# EAGLE schematic NixiTubeClock IN-14 (EAGLE 9.6.2)
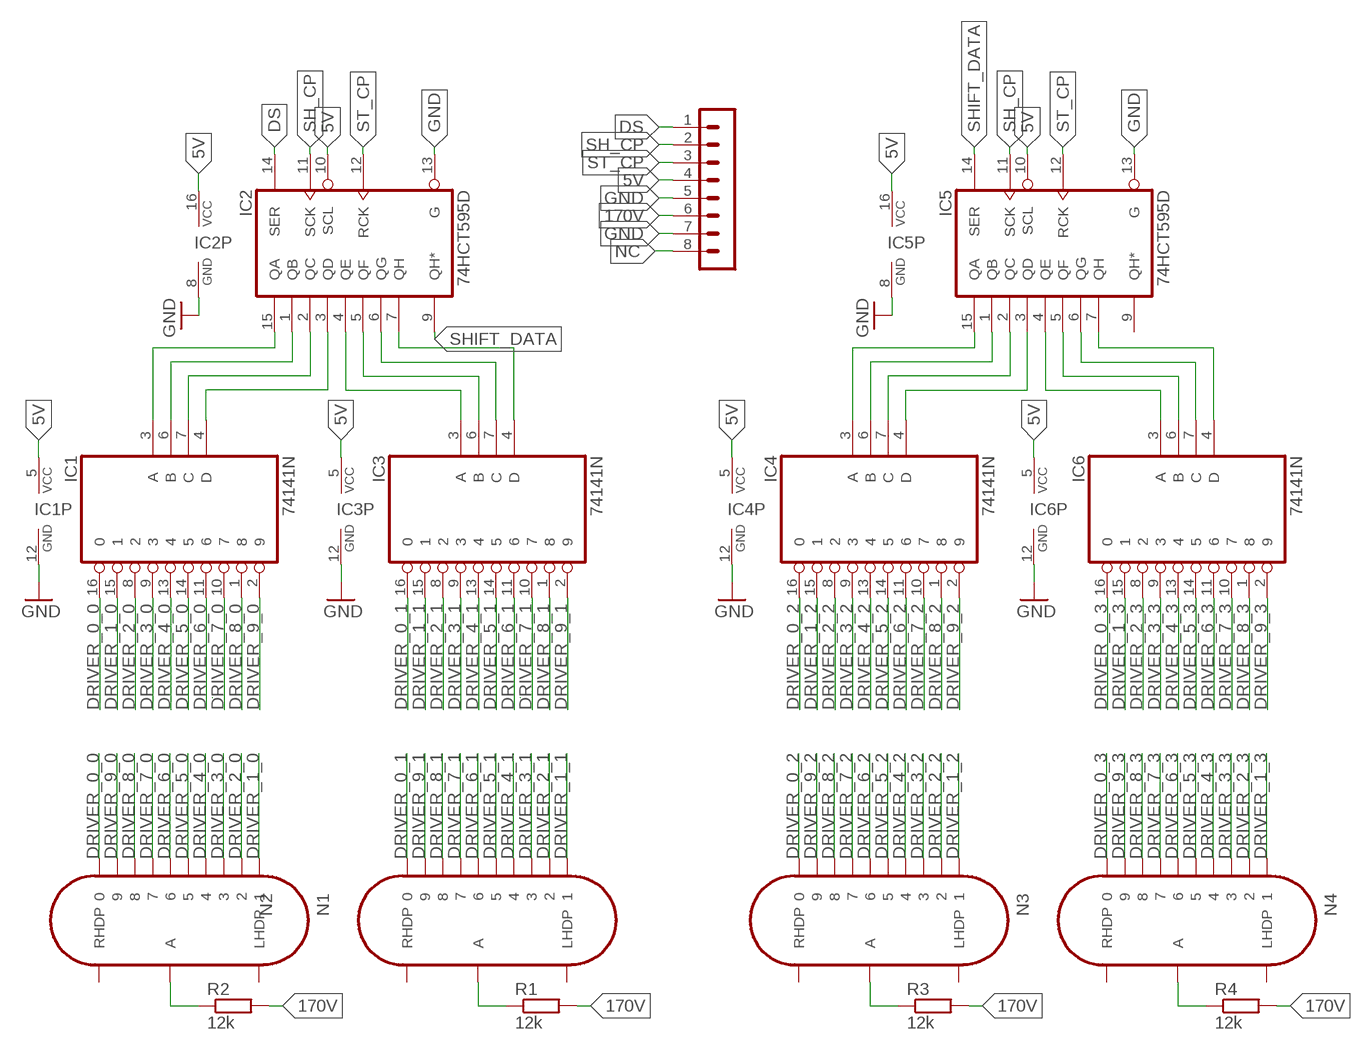
[diagram p0: schematic, sheet 1]

## Parts
IC1  74141N  [DIL16]
IC2  74HCT595D  [SO16]
IC3  74141N  [DIL16]
IC4  74141N  [DIL16]
IC5  74HCT595D  [SO16]
IC6  74141N  [DIL16]
N1  IN-14  [IN-14]
N2  IN-14  [IN-14]
N3  IN-14  [IN-14]
N4  IN-14  [IN-14]
R1  12k  R-EU_1206R1206  [R1206]
R2  12k  R-EU_1206R1206  [R1206]
R3  12k  R-EU_1206R1206  [R1206]
R4  12k  R-EU_1206R1206  [R1206]
SV2  PINHEADER-1X8  [MA08-1]

## Nets
5V: IC1.5(VCC) IC2.10(SCL) IC2.16(VCC) IC3.5(VCC) IC4.5(VCC) IC5.10(SCL) IC5.16(VCC) IC6.5(VCC) SV2.4
170V: R1.2 R2.2 R3.2 R4.2 SV2.6
DRIVER_0_0: IC1.16 N1.0
DRIVER_0_1: IC3.16 N2.0
DRIVER_0_2: IC4.16 N3.0
DRIVER_0_3: IC6.16 N4.0
DRIVER_1_0: IC1.15 N1.1
DRIVER_1_1: IC3.15 N2.1
DRIVER_1_2: IC4.15 N3.1
DRIVER_1_3: IC6.15 N4.1
DRIVER_2_0: IC1.8 N1.2
DRIVER_2_1: IC3.8 N2.2
DRIVER_2_2: IC4.8 N3.2
DRIVER_2_3: IC6.8 N4.2
DRIVER_3_0: IC1.9 N1.3
DRIVER_3_1: IC3.9 N2.3
DRIVER_3_2: IC4.9 N3.3
DRIVER_3_3: IC6.9 N4.3
DRIVER_4_0: IC1.13 N1.4
DRIVER_4_1: IC3.13 N2.4
DRIVER_4_2: IC4.13 N3.4
DRIVER_4_3: IC6.13 N4.4
DRIVER_5_0: IC1.14 N1.5
DRIVER_5_1: IC3.14 N2.5
DRIVER_5_2: IC4.14 N3.5
DRIVER_5_3: IC6.14 N4.5
DRIVER_6_0: IC1.11 N1.6
DRIVER_6_1: IC3.11 N2.6
DRIVER_6_2: IC4.11 N3.6
DRIVER_6_3: IC6.11 N4.6
DRIVER_7_0: IC1.10 N1.7
DRIVER_7_1: IC3.10 N2.7
DRIVER_7_2: IC4.10 N3.7
DRIVER_7_3: IC6.10 N4.7
DRIVER_8_0: IC1.1 N1.8
DRIVER_8_1: IC3.1 N2.8
DRIVER_8_2: IC4.1 N3.8
DRIVER_8_3: IC6.1 N4.8
DRIVER_9_0: IC1.2 N1.9
DRIVER_9_1: IC3.2 N2.9
DRIVER_9_2: IC4.2 N3.9
DRIVER_9_3: IC6.2 N4.9
DS: IC2.14(SER) SV2.1
GND: IC1.12(GND) IC2.8(GND) IC2.13(G) IC3.12(GND) IC4.12(GND) IC5.8(GND) IC5.13(G) IC6.12(GND) SV2.5 SV2.7
N$1: IC4.4(D) IC5.3(QD)
N$4: N2.A R1.1
N$5: N3.A R3.1
N$7: N4.A R4.1
N$12: N1.A R2.1
N$101: IC1.3(A) IC2.15(QA)
N$102: IC1.6(B) IC2.1(QB)
N$103: IC1.7(C) IC2.2(QC)
N$104: IC1.4(D) IC2.3(QD)
N$105: IC2.4(QE) IC3.3(A)
N$106: IC2.5(QF) IC3.6(B)
N$107: IC2.6(QG) IC3.7(C)
N$108: IC2.7(QH) IC3.4(D)
N$109: IC4.3(A) IC5.15(QA)
N$110: IC4.6(B) IC5.1(QB)
N$111: IC4.7(C) IC5.2(QC)
N$113: IC5.4(QE) IC6.3(A)
N$114: IC5.5(QF) IC6.6(B)
N$115: IC5.6(QG) IC6.7(C)
N$116: IC5.7(QH) IC6.4(D)
NC: SV2.8
SH_CP: IC2.11(SCK) IC5.11(SCK) SV2.2
SHIFT_DATA: IC2.9(QH*) IC5.14(SER)
ST_CP: IC2.12(RCK) IC5.12(RCK) SV2.3
Unconnected: IC5.9(QH*) N1.LHDP N1.RHDP N2.LHDP N2.RHDP N3.LHDP N3.RHDP N4.LHDP N4.RHDP

## Library data of the parts
IC1 IC3 IC4 IC6 = NixieTube:74*141: BCD to decimal DECODER/DRIVER
IC2 IC5 = NixieTube:74*595: 8-bit SHIFT REGISTER, output latch
N1-N4 = NixieTube:IN-14: IN-14: medium numeric frontview nixie tube
R1-R4 = CommonParts:R-EU_1206: RESISTOR, European symbol
SV2 = CommonParts:PINHEADER-1X8: PIN HEADER; OC_FARNELL: unknown; OC_NEWARK: unknown

## Net classes
0 default: width 0.2 mm, drill 0.3 mm, clearance 0.1 mm